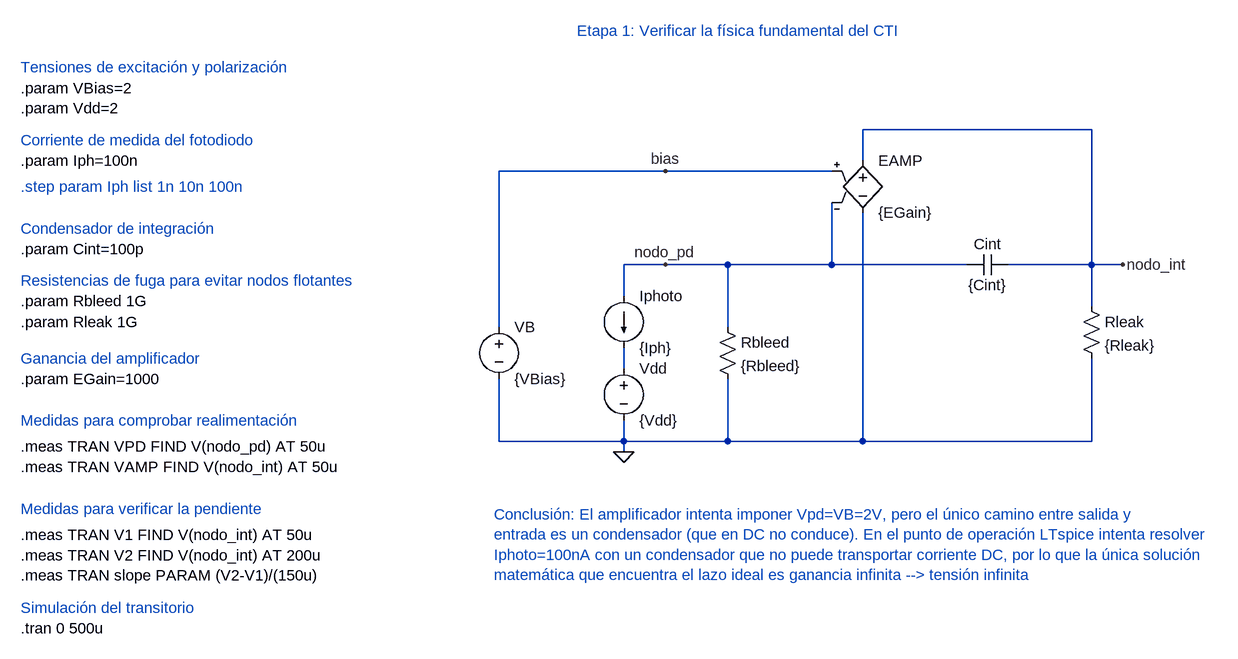
[diagram p0: schematic CTI_Etapa1.asc]
CTI_Etapa1.asc, the LTspice schematic file:
Version 4.1
SHEET 1 1244 992
WIRE 960 208 608 208
WIRE 608 256 608 208
WIRE 304 272 48 272
WIRE 560 272 304 272
WIRE 304 416 240 416
WIRE 400 416 304 416
WIRE 560 416 560 320
WIRE 560 416 400 416
WIRE 768 416 560 416
WIRE 960 416 960 208
WIRE 960 416 832 416
WIRE 1008 416 960 416
WIRE 240 464 240 416
WIRE 960 480 960 416
WIRE 48 512 48 272
WIRE 400 512 400 416
WIRE 240 576 240 544
WIRE 48 688 48 592
WIRE 240 688 240 656
WIRE 240 688 48 688
WIRE 400 688 400 592
WIRE 400 688 240 688
WIRE 608 688 608 336
WIRE 608 688 400 688
WIRE 960 688 960 560
WIRE 960 688 608 688
WIRE 240 704 240 688
FLAG 240 704 0
FLAG 304 416 nodo_pd
FLAG 1008 416 nodo_int
FLAG 304 272 bias
SYMBOL e 608 240 R0
SYMATTR InstName EAMP
SYMATTR Value {EGain}
SYMBOL voltage 48 496 R0
SYMATTR InstName VB
SYMATTR Value {VBias}
SYMBOL voltage 240 560 R0
SYMATTR InstName Vdd
SYMATTR Value {Vdd}
SYMBOL current 240 464 R0
SYMATTR InstName Iphoto
SYMATTR Value {Iph}
SYMBOL cap 768 432 R270
WINDOW 0 32 32 VTop 2
WINDOW 3 0 32 VBottom 2
SYMATTR InstName Cint
SYMATTR Value {Cint}
SYMBOL res 384 496 R0
SYMATTR InstName Rbleed
SYMATTR Value {Rbleed}
SYMBOL res 944 464 R0
SYMATTR InstName Rleak
SYMATTR Value {Rleak}
TEXT 168 56 Left 2 ;Etapa 1: Verificar la física fundamental del CTI
TEXT -688 112 Left 2 ;Tensiones de excitación y polarización
TEXT -688 144 Left 2 !.param VBias=2\n.param Vdd=2
TEXT -688 224 Left 2 ;Corriente de medida del fotodiodo
TEXT -688 256 Left 2 !.param Iph=100n
TEXT -688 360 Left 2 ;Condensador de integración
TEXT -688 392 Left 2 !.param Cint=100p
TEXT -688 560 Left 2 ;Ganancia del amplificador
TEXT -688 592 Left 2 !.param EGain=1000
TEXT -688 976 Left 2 !.tran 0 500u
TEXT -688 944 Left 2 ;Simulación del transitorio
TEXT -688 656 Left 2 ;Medidas para comprobar realimentación
TEXT -688 696 Left 2 !.meas TRAN VPD FIND V(nodo_pd) AT 50u\n.meas TRAN VAMP FIND V(nodo_int) AT 50u
TEXT -688 296 Left 2 ;.step param Iph list 1n 10n 100n
TEXT -688 792 Left 2 ;Medidas para verificar la pendiente
TEXT -688 832 Left 2 !.meas TRAN V1 FIND V(nodo_int) AT 50u\n.meas TRAN V2 FIND V(nodo_int) AT 200u\n.meas TRAN slope PARAM (V2-V1)/(150u)
TEXT -688 440 Left 2 ;Resistencias de fuga para evitar nodos flotantes
TEXT -688 472 Left 2 !.param Rbleed 1G
TEXT -688 504 Left 2 !.param Rleak 1G
TEXT 40 800 Left 2 ;Conclusión: El amplificador intenta imponer Vpd=VB=2V, pero el único camino entre salida y \nentrada es un condensador (que en DC no conduce). En el punto de operación LTspice intenta resolver\nIphoto=100nA con un condensador que no puede transportar corriente DC, por lo que la única solución \nmatemática que encuentra el lazo ideal es ganancia infinita --> tensión infinita

The netlist it stands for:
* CTI_Etapa1.asc
EAMP nodo_int 0 bias nodo_pd {EGain}
VB bias 0 {VBias}
Vdd N001 0 {Vdd}
Iphoto nodo_pd N001 {Iph}
Cint nodo_pd nodo_int {Cint}
Rbleed nodo_pd 0 {Rbleed}
Rleak nodo_int 0 {Rleak}
* Etapa 1: Verificar la física fundamental del CTI
* Tensiones de excitación y polarización
.param VBias=2
.param Vdd=2
* Corriente de medida del fotodiodo
.param Iph=100n
* Condensador de integración
.param Cint=100p
* Ganancia del amplificador
.param EGain=1000
.tran 0 500u
* Simulación del transitorio
* Medidas para comprobar realimentación
.meas TRAN VPD FIND V(nodo_pd) AT 50u
.meas TRAN VAMP FIND V(nodo_int) AT 50u
* .step param Iph list 1n 10n 100n
* Medidas para verificar la pendiente
.meas TRAN V1 FIND V(nodo_int) AT 50u
.meas TRAN V2 FIND V(nodo_int) AT 200u
.meas TRAN slope PARAM (V2-V1)/(150u)
* Resistencias de fuga para evitar nodos flotantes
.param Rbleed 1G
.param Rleak 1G
* Conclusión: El amplificador intenta imponer Vpd=VB=2V, pero el único camino entre salida y
* entrada es un condensador (que en DC no conduce). En el punto de operación LTspice intenta resolver
* Iphoto=100nA con un condensador que no puede transportar corriente DC, por lo que la única solución
* matemática que encuentra el lazo ideal es ganancia infinita --> tensión infinita
.backanno
.end

* Results of the author's LTspice run, read from the files saved beside the schematic
* From the log:
*   vpd: V(nodo_pd) =-100 at 5e-05
*   vamp: V(nodo_int) =102000 at 5e-05
*   v1: V(nodo_int) =102000 at 5e-05
*   v2: V(nodo_int) =102000 at 0.0002
*   slope: (V2-V1)/(150u)=0